# EAGLE design Nokia_Sensor_Board_V2_DIEC (EAGLE 7.7.0)
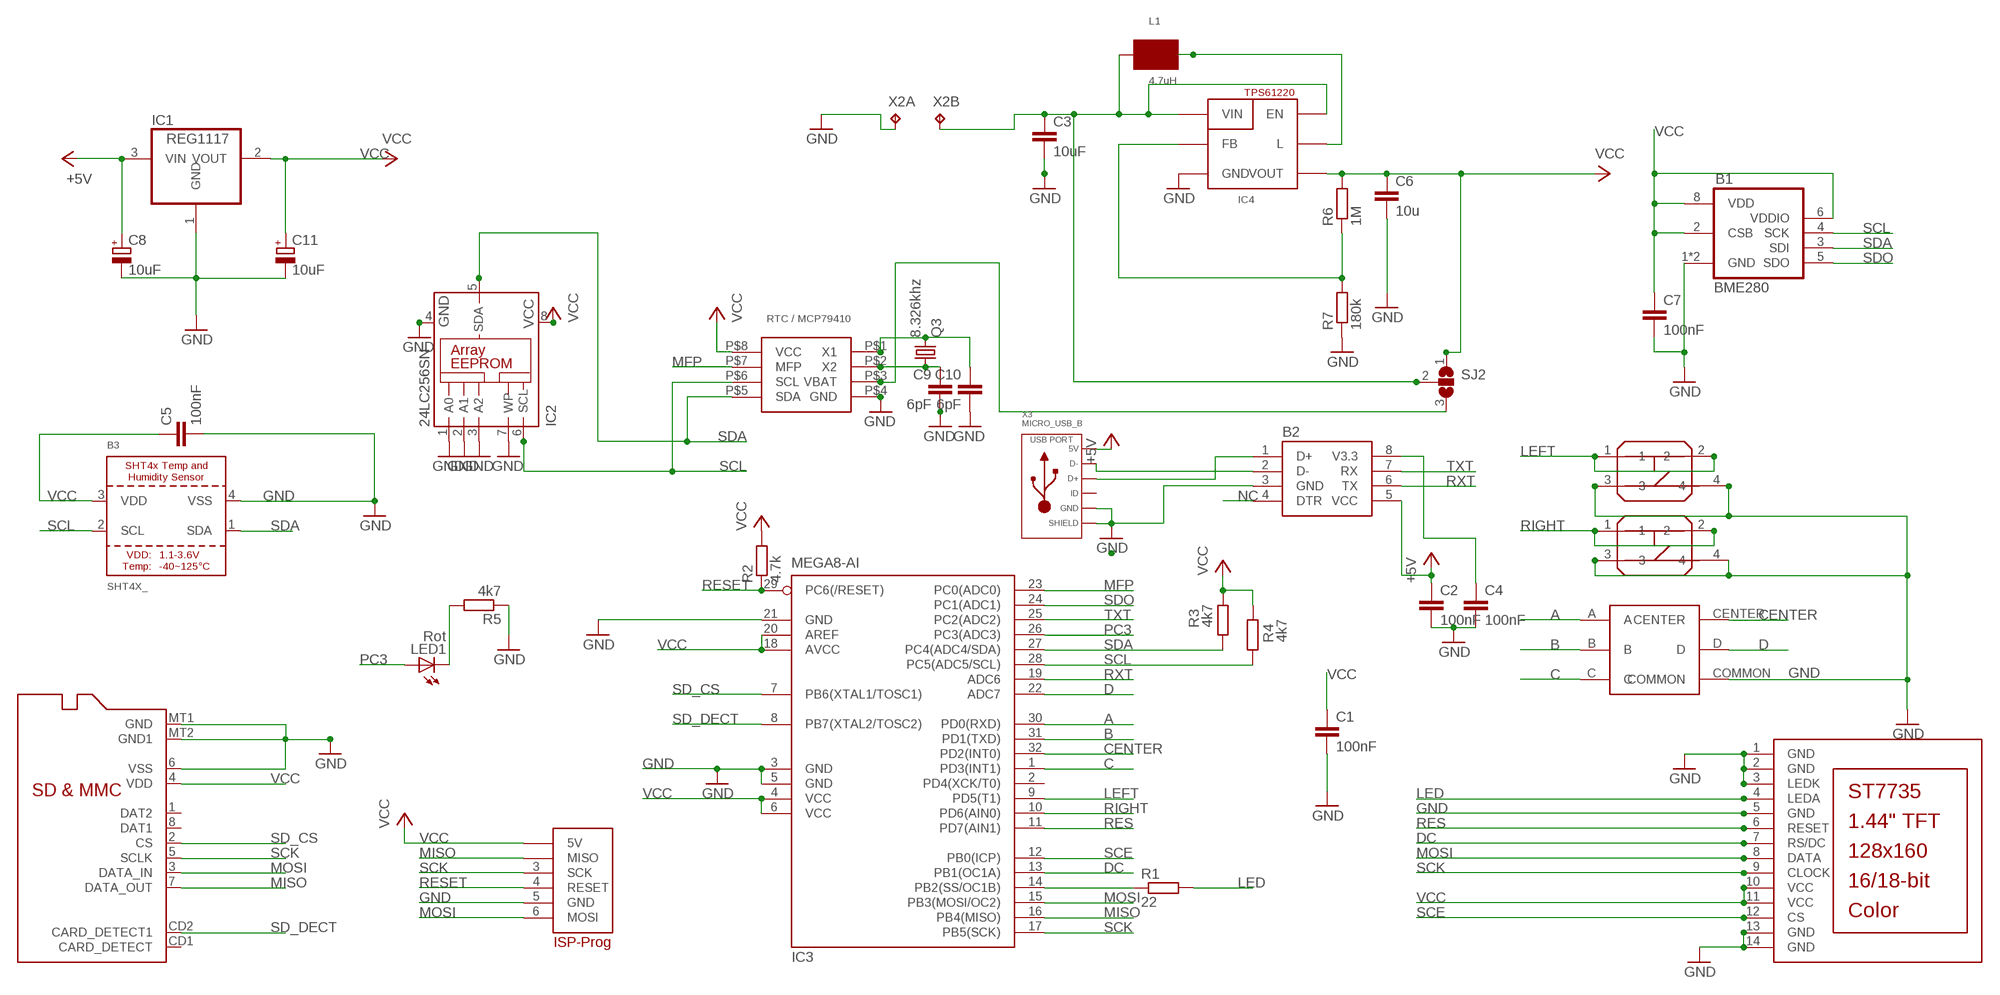
[diagram p0: schematic, sheet 1]

## Parts
B1  BME280  [BME280]
B2  CH330N  [SOIC8]
B3  SHT4X_  [SHT4X]
C1  100nF  C-EUC0805  [C0805]
C2  100nF  C-EUC0805  [C0805]
C3  10uF  C-EUC0805  [C0805]
C4  100nF  C-EUC0805  [C0805]
C5  100nF  C-EUC0805  [C0805]
C6  10u  C-EUC0805  [C0805]
C7  100nF  C-EUC0805  [C0805]
C8  10uF  CPOL-EUSMCA  [SMC_A]
C9  6pF  C-EUC0805  [C0805]
C10  6pF  C-EUC0805  [C0805]
C11  10uF  CPOL-EUSMCA  [SMC_A]
C12  MICROSD  [MICROSD]
IC1  REG1117  [SOT223]
IC2  24LC256SN  [SO-08]
IC3  MEGA8-AI  [TQFP32-08]
IC4  TPS6122X  [TPS6122X]
L1  4.7uH  SPULE_SMD  [SPULE_SMD]
LED1  Rot  LEDSML0805  [SML0805]
P1  DISP_LCD_ST7735_1.44IN  [TFT_1.44IN_128_128]
P2  MCP79410  [MCP79410]
Q3  8.326khz  CRYSTALTC38H  [TC38H]
R1  22  R-EU_M0805  [M0805]
R2  4.7k  R-EU_M0805  [M0805]
R3  4k7  R-EU_M0805  [M0805]
R4  4k7  R-EU_M0805  [M0805]
R5  4k7  R-EU_M0805  [M0805]
R6  1M  R-EU_R0805  [R0805]
R7  180k  R-EU_R0805  [R0805]
S1  TASTER_GROSS  [TASTER_GROSS]
S2  SKQUCAA010  [SKQUCAA010]
S3  TASTER_GROSS  [TASTER_GROSS]
SJ2  SJ2W  [SJ_2]
X1  ISP_PROG_STECKERJST-PH6  [ISP_PROG_JST_PH6]
X2  TP2P2-38-17  [P2-38-17]
X3  MICRO_USB_B  [MICRO_USB_B]

## Nets
+5V: B2.5(VCC) C2.1 C8.+ IC1.3(VIN) X3.1(5V)
A: IC3.30(PD0(RXD)) S2.A
B: IC3.31(PD1(TXD)) S2.B
C: IC3.1(PD3(INT1)) S2.C
CENTER: IC3.32(PD2(INT0)) S2.CENTER
D: IC3.22(ADC7) S2.D
D+: B2.1(D+) X3.3(D+)
D-: B2.2(D-) X3.2(D-)
DC: IC3.13(PB1(OC1A)) P1.7(RS/DC)
GND: B1.1(GND) B1.7(GND) B2.3(GND) B3.4(VSS) C1.2 C2.2 C3.2 C4.2 C5.2 C6.2 C7.2 C8.- C9.2 C10.2 C11.- C12.6(VSS) C12.MT1(GND) C12.MT2(GND1) IC1.1(GND) IC2.1(A0) IC2.2(A1) IC2.3(A2) IC2.4(GND) IC2.7(WP) IC3.3(GND) IC3.5(GND) IC3.21(GND) IC4.P$3(GND) P1.1(GND) P1.2(GND) P1.3(LEDK) P1.5(GND) P1.13(GND) P1.14(GND) P2.P$4(GND) R5.1 R7.1 S1.3 S1.4 S2.COMMON S3.3 S3.4 X1.5(GND) X2.TP-1 X3.5(GND) X3.S1(SLD) X3.S2(SLD) X3.S5(SLD) X3.S6(SLD) X3.S7(SLD) X3.S8(SLD)
LED: P1.4(LEDA) R1.2
LEFT: IC3.9(PD5(T1)) S1.1 S1.2
MFP: IC3.23(PC0(ADC0)) P2.P$7(MFP)
MISO: C12.7(DATA_OUT) IC3.16(PB4(MISO)) X1.2(MISO)
MOSI: C12.3(DATA_IN) IC3.15(PB3(MOSI/OC2)) P1.8(DATA) X1.6(MOSI)
N$2: P2.P$3(VBAT) SJ2.3
N$3: LED1.C R5.2
N$10: B2.8(V3.3) C4.1
N$11: IC3.14(PB2(SS/OC1B)) R1.1
N$22: IC4.P$2(FB) R6.1 R7.2
N$23: C3.1 IC4.P$1(VIN) IC4.P$6(EN) L1.P$2(.) SJ2.2 X2.TP-2
N$26: IC4.P$5(L) L1.P$1(-)
N$37: C9.1 P2.P$2(X2) Q3.1
N$38: C10.1 P2.P$1(X1) Q3.2
NC: B2.4(DTR)
PC3: IC3.26(PC3(ADC3)) LED1.A
RES: IC3.11(PD7(AIN1)) P1.6(RESET)
RESET: IC3.29(PC6(/RESET)) R2.1 X1.4(RESET)
RIGHT: IC3.10(PD6(AIN0)) S3.1 S3.2
RXT: B2.6(TX) IC3.19(ADC6)
SCE: IC3.12(PB0(ICP)) P1.12(CS)
SCK: C12.5(SCLK) IC3.17(PB5(SCK)) P1.9(CLOCK) X1.3(SCK)
SCL: B1.4(SCK) B3.2(SCL) IC2.6(SCL) IC3.28(PC5(ADC5/SCL)) P2.P$6(SCL) R4.1
SD_CS: C12.2(CS) IC3.7(PB6(XTAL1/TOSC1))
SD_DECT: C12.CD2(CARD_DETECT1) IC3.8(PB7(XTAL2/TOSC2))
SDA: B1.3(SDI) B3.1(SDA) IC2.5(SDA) IC3.27(PC4(ADC4/SDA)) P2.P$5(SDA) R3.1
SDO: B1.5(SDO) IC3.24(PC1(ADC1))
TXT: B2.7(RX) IC3.25(PC2(ADC2))
VCC: B1.2(CSB) B1.6(VDDIO) B1.8(VDD) B3.3(VDD) C1.1 C5.1 C6.1 C7.1 C11.+ C12.4(VDD) IC1.2(VOUT) IC2.8(VCC) IC3.4(VCC) IC3.6(VCC) IC3.18(AVCC) IC3.20(AREF) IC4.P$4(VOUT) P1.10(VCC) P1.11(VCC) P2.P$8(VCC) R2.2 R3.2 R4.2 R6.2 SJ2.1 X1.1(5V)
Unconnected: C12.1(DAT2) C12.8(DAT1) C12.CD1(CARD_DETECT) IC3.2(PD4(XCK/T0)) X3.4(ID)

## Library data of the parts
B1 = bosch-bme280:BME280: DIGITAL HUMIDITY, PRESSURE AND TEMPERATURE SENSOR * Digital interface I²C (up to 3.4 MHz) and SPI (3 and 4 wire, up to 10 MHz)* Supply voltage VDD main supply voltage range: 1.71 V to 3.6 V*VDDIO interface voltage range: 1.2 V to 3.6 V Operating range -40…+85 °C, 0…100 % rel. humidity, 300…1100 hPa The library has been designed by Richard Magdycz <https://www.facebook.com/groups/eaglecadsoftUK>
B2 = ch330n:CH330N
B3 = adafruit_sensor:SHT4X
C1-C7 C9 C10 = rcl:C-EU: CAPACITOR, European symbol
C8 C11 = rcl:CPOL-EU: POLARIZED CAPACITOR, European symbol
C12 = adafruit:MICROSD: Micro-SD / Transflash card holder with SPI pinout For the 3M # 2908-05WB-MG and/or 4UCON #19656 push-push type
IC1 = burr-brown:REG1117: 800mA and 1A Low Dropout (LDO) Positive Regulator 1.8V, 2.5V, 2.85V, 3.3V, 5V, and Adj; MPN: REG1117; OC_FARNELL: 1097566; OC_NEWARK: 14P6981
IC2 = microchip:24*: Serial EEPROM I2C; MF: MICROCHIP; MPN: 24LC256-I/SN; OC_FARNELL: 9757996; OC_NEWARK: 27C9144
IC3 = atmel:MEGA8: MICROCONTROLLER 8 Kbytes FLASH, 1 kbytes SRAM, 512 bytes EEPROM, USART, 6-channel 10 bit ADC, 2-channel 8 bit ADC Pin compatible with Atmega48, ATMega88, ATMega168 Source: avr.lbr; MPN: ATMEGA8-16AU; OC_FARNELL: 9171371; OC_NEWARK: 73M8863
IC4 = taster_smd_omron:TPS6122X
L1 = taster_smd_omron:SPULE_SMD
LED1 = led:LED: LED OSRAM: - CHIPLED LG R971, LG N971, LY N971, LG Q971, LY Q971, LO R971, LY R971 LH N974, LH R974 LS Q976, LO Q976, LY Q976 LO Q996 - Hyper CHIPLED LW Q18S LB Q993, LB Q99A, LB R99A - SideLED LS A670, LO A670, LY A670, LG A670, LP A670 LB A673, LV A673, LT A673, LW A673 LH A674 LY A675 LS A676, LA A676, LO A676, LY A676, LW A676 LS A679, LY A679, LG A679 - Hyper Micro SIDELED® LS Y876, LA Y876, LO Y876, LY Y876 LT Y87S - SmartLED LW L88C, LW L88S LB L89C, LB L89S, LG L890 LS L89K, LO L89K, LY L89K LS L896, LA L896, LO L896, LY L896 - TOPLED LS T670, LO T670, LY T670, LG T670, LP T670 LSG T670, LSP T670, LSY T670, LOP T670, LYG T670 LG T671, LOG T671, LSG T671 LB T673, LV T673, LT T673, LW T673 LH T674 LS T676, LA T676, LO T676, LY T676, LB T676, LH T676, LSB T676, LW T676 LB T67C, LV T67C, LT T67C, LS T67K, LO T67K, LY T67K, LW E67C LS E67B, LA E67B, LO E67B, LY E67B, LB E67C, LV E67C, LT E67C LW T67C LS T679, LY T679, LG T679 LS T770, LO T770, LY T770, LG T770, LP T770 LB T773, LV T773, LT T773, LW T773 LH T774 LS E675, LA E675, LY E675, LS T675 LS T776, LA T776, LO T776, LY T776, LB T776 LHGB T686 LT T68C, LB T68C - Hyper Mini TOPLED® LB M676 - Mini TOPLED Santana® LG M470 LS M47K, LO M47K, LY M47K Source: http://www.osram.convergy.de LUXEON: - LUMILED® LXK2-PW12-R00, LXK2-PW12-S00, LXK2-PW14-U00, LXK2-PW14-V00 LXK2-PM12-R00, LXK2-PM12-S00, LXK2-PM14-U00 LXK2-PE12-Q00, LXK2-PE12-R00, LXK2-PE12-S00, LXK2-PE14-T00, LXK2-PE14-U00 LXK2-PB12-K00, LXK2-PB12-L00, LXK2-PB12-M00, LXK2-PB14-N00, LXK2-PB14-P00, LXK2-PB14-Q00 LXK2-PR12-L00, LXK2-PR12-M00, LXK2-PR14-Q00, LXK2-PR14-R00 LXK2-PD12-Q00, LXK2-PD12-R00, LXK2-PD12-S00 LXK2-PH12-R00, LXK2-PH12-S00 LXK2-PL12-P00, LXK2-PL12-Q00, LXK2-PL12-R00 Source: www.luxeon.com KINGBRIGHT: KA-3528ASYC Source: www.kingbright.com
P1 = microbuilder:DISP_LCD_ST7735_1.44IN
P2 = taster_smd_omron:MCP79410
Q3 = crystal:CRYSTAL: CRYSTAL; OC_FARNELL: unknown; OC_NEWARK: unknown
R1-R7 = rcl:R-EU_: RESISTOR, European symbol
S1 S3 = RUAG_EL_LW:TASTER_GROSS
S2 = Joystick:SKQUCAA010
SJ2 = jumper:SJ2W: SMD solder JUMPER
X1 = LW_DUB:ISP_PROG_STECKER
X2 = testpad:TP2: Test pad
X3 = LW_DUB:MICRO_USB_B

## Board
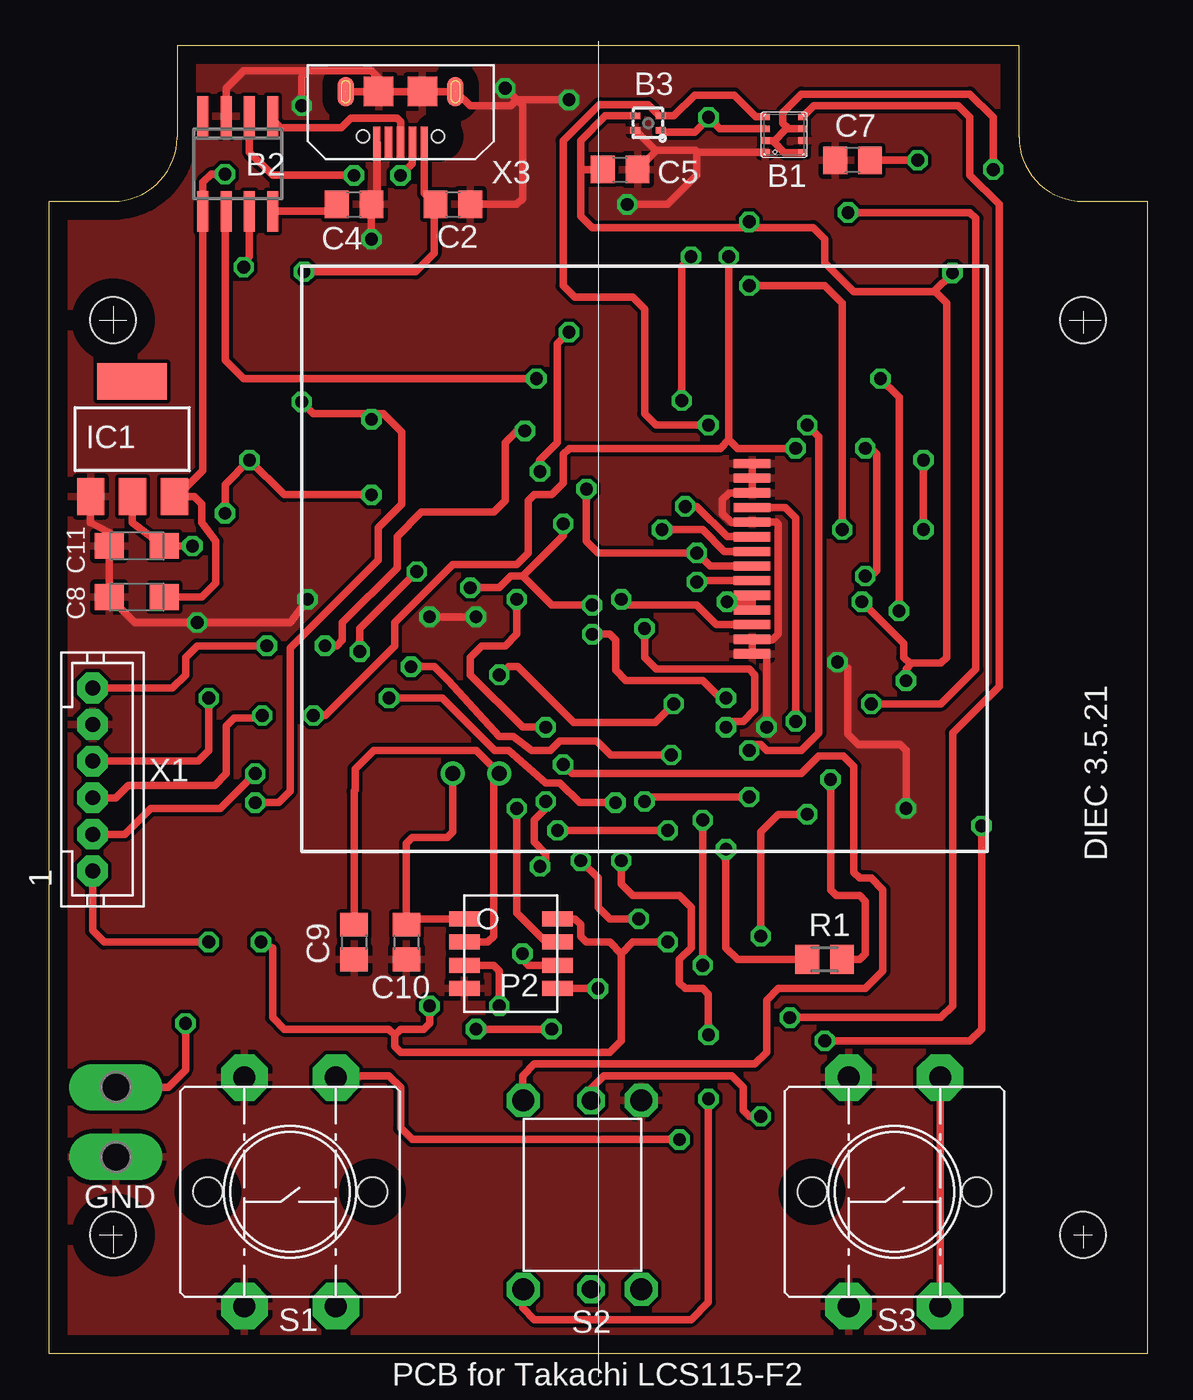
[diagram p1: board, top side]
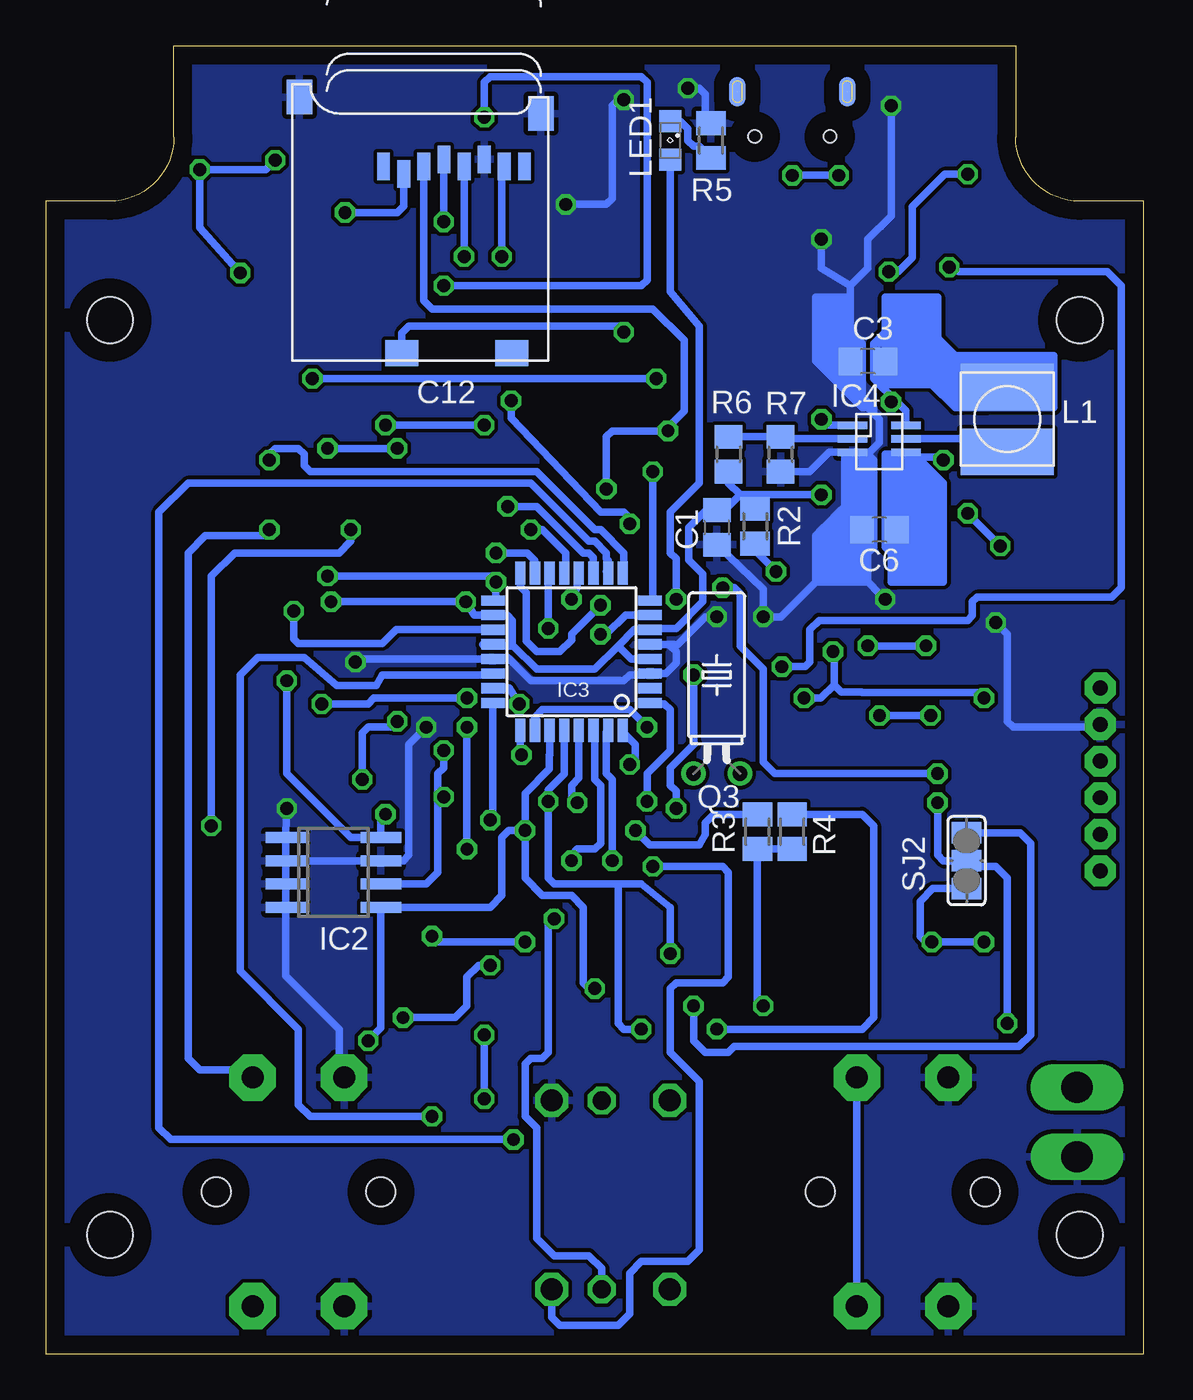
[diagram p2: board, bottom side, seen from below]

Size 60 x 71.5 mm. Coordinates in mm from the lower left corner, seen from the top.
Copper layers (1*16): Top 0.035mm / dielectric 1.5mm / Bottom 0.035mm
Design rules "default": minimum track width 10mil, minimum drill 24mil, track to track 8mil, track to pad 8mil, pad to pad 8mil, via to via 8mil, smd to smd 8mil, copper to edge 40mil, drill to drill 8mil, minimum pad ring 10mil, minimum via ring 8mil, stop-mask expansion 4mil, vias tented up to drill 0mil, thermal gap 10mil

### Footprints (pad centres in the part's own frame; a part is rotated, then mirrored left to right if it is on the bottom)
BME280 = smd 0.35 x 0.5: 1 0.975,-1.025; 2 0.325,-1.025; 3 -0.325,-1.025; 4 -0.975,-1.025; 5 -0.975,1.025; 6 -0.325,1.025; 7 0.325,1.025; 8 0.975,1.025
SOIC8 = smd 0.6 x 2.2: 1 -1.905,-2.6; 2 -0.635,-2.6; 3 0.635,-2.6; 4 1.905,-2.6; 5 1.905,2.6; 6 0.635,2.6; 7 -0.635,2.6; 8 -1.905,2.6
SHT4X = smd 0.55 x 0.35: 1 -0.7,0.4; 2 -0.7,-0.4; 3 0.7,-0.4; 4 0.7,0.4
C0805 = smd 1.3 x 1.5: 1 -0.95,0; 2 0.95,0
SMC_A = smd 1.6 x 1.4: + -1.5,0; - 1.5,0
MICROSD = smd 0.7 x 1.5: 1 9,-10.64; 2 7.9,-10.24; 3 6.8,-10.64; 4 5.7,-11.04; 5 4.6,-10.64; 6 3.5,-11.04; 7 2.4,-10.64; 8 1.3,-10.64 | smd 1.8 x 1.4: CD1 2,-0.44; CD2 8,-0.44 | smd 1.4 x 1.9: MT1 0.4,-13.54; MT2 13.6,-14.44
SOT223 = smd 1.499 x 2.007: 1 -2.261,-3.15; 2 0.025,-3.15; 3 2.311,-3.15 | smd 3.81 x 2.007: 4 0,3.15
SO-08 = smd 0.6 x 2.2: 1 -1.905,-2.6; 2 -0.635,-2.6; 3 0.635,-2.6; 4 1.905,-2.6; 5 1.905,2.6; 6 0.635,2.6; 7 -0.635,2.6; 8 -1.905,2.6
TQFP32-08 = smd 1.27 x 0.559: 1 -4.293,2.8; 2 -4.293,2; 3 -4.293,1.2; 4 -4.293,0.4; 5 -4.293,-0.4; 6 -4.293,-1.2; 7 -4.293,-2; 8 -4.293,-2.8; 17 4.293,-2.8; 18 4.293,-2; 19 4.293,-1.2; 20 4.293,-0.4; 21 4.293,0.4; 22 4.293,1.2; 23 4.293,2; 24 4.293,2.8 | smd 0.559 x 1.27: 9 -2.8,-4.293; 10 -2,-4.293; 11 -1.2,-4.293; 12 -0.4,-4.293; 13 0.4,-4.293; 14 1.2,-4.293; 15 2,-4.293; 16 2.8,-4.293; 25 2.8,4.293; 26 2,4.293; 27 1.2,4.293; 28 0.4,4.293; 29 -0.4,4.293; 30 -1.2,4.293; 31 -2,4.293; 32 -2.8,4.293
TPS6122X = smd 0.406 x 1.613: P$1 -0.31,-1.47; P$2 0.426,-1.47; P$3 1.163,-1.47; P$4 1.163,1.438; P$5 0.426,1.438; P$6 -0.31,1.438
SPULE_SMD = smd 2.54 x 5.08: P$1 -1.778,0; P$2 1.778,0
SML0805 = smd 1.2 x 1.2: A 1.05,0; C -1.05,0
TFT_1.44IN_128_128 = smd 0.5 x 2: 1 5.2,12.855; 2 4.4,12.855; 3 3.6,12.855; 4 2.8,12.855; 5 2,12.855; 6 1.2,12.855; 7 0.4,12.855; 8 -0.4,12.855; 9 -1.2,12.855; 10 -2,12.855; 11 -2.8,12.855; 12 -3.6,12.855; 13 -4.4,12.855; 14 -5.2,12.855
MCP79410 = smd 0.813 x 1.676: P$1 -2.54,-2.54; P$2 -1.27,-2.54; P$3 0,-2.54; P$4 1.27,-2.54; P$5 1.27,2.54; P$6 0,2.54; P$7 -1.27,2.54; P$8 -2.54,2.54
TC38H = drill 0.813: 1 -1.27,0; 2 1.27,0
M0805 = smd 1.3 x 1.6: 1 -0.95,0; 2 0.95,0
R0805 = smd 1.3 x 1.5: 1 -0.95,0; 2 0.95,0
TASTER_GROSS = drill 1.2 pad 2.54 octagon: 1 6.25,-2.5; 2 -6.25,-2.5; 3 6.25,2.5; 4 -6.25,2.5 | hole 1.6: 0,4.5; 0,-4.5
SKQUCAA010 = drill 1.2 octagon: A -5.01,3.14; C -5.01,-3.31; CENTER 5.31,3.14; COMMON 5.31,-3.31 | drill 1 octagon: B -5.01,-0.57; D 5.31,-0.57
SJ_2 = smd 1.168 x 1.6: 1 -1.524,0; 2 0,0; 3 1.524,0
PCB_LSC115_F2 = hole 2.5: -26.5,22.25; 26.5,22.25; 26.5,-27.75; -26.5,-27.75
ISP_PROG_JST_PH6 = drill 0.813 pad 1.676 octagon: 1 5,0; 2 3,0; 3 1,0; 4 -1,0; 5 -3,0; 6 -5,0
P2-38-17 = drill 1.702 pad 2.121 long: TP-1 -1.905,0; TP-2 1.905,0
MICRO_USB_B = smd 0.4 x 1.7: 1 -1.3,1.37; 2 -0.65,1.37; 3 0,1.37; 4 0.65,1.37; 5 1.3,1.37 | smd 0.9 x 1.6: S1 -3,-1.4; S2 3,-1.4 | smd 1.6 x 1.6: S5 -1.2,-1.405; S6 1.2,-1.405 | smd 0.9 x 1.6 bottom: S7 -3,-1.4; S8 3,-1.4 | hole 0.7: -2.05,1.05; 2.05,1.05

### Placement (x,y rotation side)
B1  40.16,66.64 270 top
B2  10.32,65.05 180 top
B3  32.73,67.27 180 top
C1  23.33,45.17 270 bottom
C2  22.06,62.83 0 top
C3  15.08,54.25 180 bottom
C4  16.66,62.83 0 top
C5  31.21,64.73 0 top
C6  14.44,45.05 180 bottom
C7  43.91,65.24 180 top
C8  4.79,41.36 180 top
C9  16.66,22.5 270 top
C10  19.52,22.5 270 top
C11  4.79,44.16 180 top
C12  32.54,54.25 180 bottom
IC1  4.54,50 0 top
IC2  44.29,26.31 270 bottom
IC3  31.27,38.38 180 bottom
IC4  14.44,50.44 270 bottom
L1  7.46,51.08 90 bottom
LED1  25.87,66.32 270 bottom
P1  51.27,43.46 90 top
P2  25.24,21.23 270 top
Q3  23.33,31.71 0 bottom
R1  42.38,21.55 0 top
R2  21.24,45.24 90 bottom
R3  21.11,28.54 270 bottom
R4  19.21,28.54 270 bottom
R5  23.65,66.32 270 bottom
R6  22.7,49.17 270 bottom
R7  19.84,49.17 90 bottom
S1  46.19,8.85 90 top
S2  29.05,8.53 90 top
S3  13.17,8.85 90 top
SJ2  9.68,26.95 90 bottom
U$1  [PCB_LSC115_F2]  30,34.25 0 top
X1  2.38,31.39 270 top
X2  3.65,12.66 90 top
X3  19.21,67.59 180 top

### Tracks (layer width: path | path; a pad name or v marks a point on that pad's centre or on a via)
+5V  (via drill 0.7)
  Top 0.406: C2.1 21.05,62.89 | X3.1 20.5,63.43 21.05,62.89 | C8.+ 8.35,41.36 9.11,42.13 9.11,44.41 8.35,45.43 8.35,46.44 7.94,46.85 IC1.3 6.97,46.85 8.41,48.29 B2.5 8.41,64.03 8.85,64.48 v9.62,64.48 | 21.05,62.89 21.05,60.16 20.03,59.14 v13.93,59.14
  Bottom 0.406: v9.62,64.48 10.89,64.48 12.66,62.7 12.66,59.91 13.43,59.14 v13.93,59.14
A  (via drill 0.7)
  Top 0.406: S2.A 25.87,3.49 25.87,2.5 26.51,1.87 35.08,1.87 36.03,2.82 v36.03,13.93 | v31.27,26.95 31.27,25.68 31.9,25.04 34.44,25.04 35.08,24.41 35.08,22.19 34.44,21.55 34.44,20.28 34.76,19.97 35.71,19.97 36.03,19.65 v36.03,17.42
  Bottom 0.406: IC3.30 30,34.02 30,31.4 29.68,31.08 29.68,27.9 30,27.58 30.95,27.58 31.27,27.27 v31.27,26.95 | v36.03,13.93 v36.03,17.42
B  (via drill 0.7)
  Top 0.406: v29.05,26.95 30,26 30,24.41 30.63,23.77 v32.22,23.77
  Bottom 0.406: v29.05,26.95 29.05,31.4 29.37,31.71 29.37,33.99 29.27,33.99 IC3.31 | S2.B 29.62,4.66 30.32,5.36 32.22,5.36 33.17,6.31 33.17,12.35 33.81,12.98 33.81,15.84 33.49,16.15 32.86,16.15 32.54,16.47 32.54,23.46 v32.22,23.77
C  (via drill 0.7)
  Top 0.406: v26.83,26.63 27.14,26.95 27.14,27.33 26.51,27.97 26.51,29.17 27.14,29.81 v27.14,30.19
  Bottom 0.406: IC3.1 26.92,35.52 26.19,35.52 25.87,35.2 25.87,32.98 27.14,31.71 v27.14,30.19 | S2.C 32.36,2 31.9,1.55 28.73,1.55 28.1,2.19 28.1,4.41 27.46,5.04 24.92,5.04 24.28,5.68 24.28,14.88 25.87,16.47 25.87,19.97 25.56,20.28 23.01,20.28 22.7,20.6 22.7,26.31 23.01,26.63 v26.83,26.63
CENTER  (via drill 0.7 pad 0.3)
  Top 0.406: S2.CENTER 25.87,13.88 25.87,15.2 26.51,15.84 38.57,15.84 39.21,16.47 39.21,19.33 39.84,19.97 44.6,19.97 45.56,20.92 45.56,25.36 44.92,26 44.29,26 43.97,26.31 43.97,32.09 43.4,32.67 42.06,32.67 41.11,31.71 28.59,31.71 v28.09,32.21
  Bottom 0.406: 28.41,34.03 IC3.32 28.47,33.99 27.78,33.3 27.78,32.53 v28.09,32.21
D  (via drill 0.7)
  Top 0.406: S2.D 29.62,14.5 30.32,15.2 37.3,15.2 37.94,14.57 37.94,13.3 38.26,12.98 v38.89,12.98
  Bottom 0.406: IC3.22 35.63,37.11 41.62,37.11 41.94,36.54 44.1,36.54 45.88,38.06 48.42,38.06 49.37,37.11 49.37,20.92 46.19,17.74 46.19,13.61 45.56,12.98 v38.89,12.98
D+
  Top 0.406: B2.1 12.22,67.46 12.66,67.02 15.97,67.02 16.47,67.53 19.01,67.53 19.21,67.34 X3.3
D-  (via drill 0.7)
  Top 0.406: B2.2 10.95,65.68 12.22,64.42 v16.66,64.42 | v19.21,64.42 19.86,65.06 X3.2
  Bottom 0.406: v16.66,64.42 v19.21,64.42
DC  (via drill 0.7)
  Top 0.406: v33.49,45.05 35.71,45.05 36.9,43.86 P1.7
  Bottom 0.406: IC3.13 31.59,42.76 31.59,43.78 32.86,45.05 v33.49,45.05
GND  (via drill 0.7, 0.7 pad 0.3)  (2 unrouted)
  Top 0.406: 37.78,38.23 P1.14 | P1.1 P1.2 P1.3 37.16,47.06 36.79,46.7 36.79,45.94 37.3,45.43 38.39,45.43 P1.5 39.75,45.46 39.84,45.37 39.84,39.33 39.53,39.02 38.37,39.02 P1.13 P1.14 | v14.13,41.24 13.17,39.97 v8.09,39.97 4.69,39.97 C8.- C11.- 3.29,44.9 2.25,45.43 2.25,46.83 IC1.1 | v20.79,40.28 v23.33,40.28 | v39.21,34.25 39.21,38.06 39.01,38.26 P1.14 | X3.S6 17.94,69.06 17.94,69.81 17.62,70.13 14.13,70.13 | 14.13,70.13 13.81,69.81 v13.81,68.23 | X3.S8 X3.S6 | C4.2 17.9,63.12 X3.5 17.94,66.19 17.94,62.51 17.62,62.19 v17.62,60.92 | v43.08,37.81 43.65,37.49 43.65,33.87 44.22,33.3 46.51,33.3 46.83,32.98 v46.83,29.81 | 39.11,65.68 35.4,65.68 | 35.4,65.68 35.3,65.78 33.12,65.78 | C2.2 25.56,62.83 25.87,63.14 25.87,68.23 25.56,68.54 | 25.56,68.54 v28.41,68.54 | v31.59,62.83 33.81,62.83 35.4,64.42 35.4,65.68 | X3.S6 X3.S5 X3.S7 22.65,68.54 22.7,68.54 23.01,68.23 25.24,68.23 25.56,68.54 | B2.3 9.68,69.18 10.63,70.13 14.13,70.13 | v24.92,69.18 25.56,68.54 | B3.4 33.12,65.78 | C5.2 33.12,65.7 33.12,65.78
  Bottom 0.406: v8.09,39.97 7.46,39.33 7.46,34.57 7.14,34.25 2.52,34.25 X1.5 | IC2.2 IC2.1 46.89,28.48 v46.83,29.81 | IC2.2 IC2.3 IC2.4 46.89,20.66 43.97,17.74 43.97,15.38 | IC2.2 IC2.7 40.48,26.95 40.16,27.27 40.16,33.3 v39.21,34.25 | 26.91,37.11 IC3.3 | C6.2 14.76,45.68 | 14.76,45.68 14.76,44.1 15.08,43.78 15.08,43.14 | 15.08,43.14 15.08,42.19 17.94,42.19 | 17.94,42.19 17.94,44.73 17.62,45.05 | 17.3,45.37 16.66,46 | 15.71,48.54 15.71,49.08 IC4.P$3 | 15.71,45.68 15.71,43.78 | 15.39,43.46 15.08,43.14 | IC4.P$3 16.03,49.16 16.03,44.1 15.71,44.41 15.08,44.41 15.08,44.1 15.39,44.1 15.39,43.46 | 15.39,43.46 15.39,43.14 | 15.39,43.14 15.39,42.51 | 15.39,42.51 17.62,42.51 17.62,42.82 15.71,42.82 15.39,43.14 | 15.39,43.14 17.62,43.14 17.62,43.46 15.39,43.46 | 15.39,43.46 15.71,43.78 | 15.71,43.78 17.62,43.78 17.62,44.1 16.35,44.1 16.35,44.41 17.62,44.41 17.62,44.73 16.35,44.73 16.35,45.05 17.62,45.05 | 17.62,45.05 17.3,45.37 | 17.3,45.37 16.66,45.37 16.35,45.68 16.66,45.68 16.35,45.37 16.35,46 16.66,46 | 16.66,46 16.35,46.32 | 16.35,46.32 16.35,49.17 15.71,48.54 | 15.71,48.54 15.71,45.68 | 15.71,45.68 15.39,45.68 15.39,49.17 14.76,48.54 | 14.76,47.91 14.76,45.68 | 14.76,45.68 | 14.76,45.68 15.08,45.68 15.08,48.54 14.76,48.86 | 14.76,48.86 14.76,48.54 | 16.35,46.32 14.76,47.91 | 14.76,47.91 14.76,48.54 | 14.76,48.86 15.08,49.17 | 16.03,49.17 15.08,49.17 | 15.08,52.03 15.39,52.35 15.39,55.21 16.03,55.84 16.03,57.11 | 16.03,57.11 16.03,57.75 | 16.03,57.75 16.35,57.75 | 16.35,57.75 17.94,57.75 17.94,57.11 | 17.94,57.11 17.94,56.48 | 17.94,56.48 17.94,54.25 15.39,51.71 15.08,51.71 | 14.76,51.4 14.76,51.71 15.08,52.03 | 15.08,52.03 15.39,52.03
  Bottom 0.406: 15.39,52.03 15.08,51.71 | 15.39,52.03 16.03,52.67 16.03,52.99 15.71,52.67 15.71,55.21 16.66,55.21 | 16.66,55.21 16.98,55.21 17.3,55.52 17.3,55.84 | 17.3,55.84 16.98,55.52 16.35,55.52 | 16.35,55.52 16.03,55.52 16.35,55.84 | 16.66,56.16 16.35,55.84 | 16.35,55.84 16.35,55.52 | 16.35,55.84 16.35,56.48 | 16.35,56.48 16.35,57.75 | 16.35,57.75 16.66,57.43 17.62,57.43 17.94,57.11 | 17.94,57.11 16.03,57.11 | 16.03,57.11 16.35,56.8 17.62,56.8 17.3,56.48 | 17.3,56.48 16.35,56.48 | 17.3,56.48 17.94,56.48 | 17.94,56.48 17.62,56.16 | 17.62,56.16 17.3,55.84 | 17.3,55.84 16.66,55.84 16.98,56.16 17.62,56.16 | 17.62,56.16 17.62,54.57 17.3,54.25 | 16.98,53.94 16.35,53.3 16.35,52.99 17.62,54.25 17.3,54.57 | 17.3,54.57 17.3,55.21 16.66,54.57 16.66,55.21 | 16.66,55.21 17.3,54.57 | 17.3,54.57 17.3,54.25 | 17.3,54.25 16.98,53.94 | 16.98,53.94 16.66,53.94 | 16.66,53.94 16.03,53.3 | 16.66,53.94 17.3,54.57 | 17.3,54.57 16.98,54.57 16.66,54.25 C3.2 | R7.1 18.25,48.22 17.19,49.28 IC4.P$3 | v14.13,41.24 15.39,42.51 | 17.94,42.19 19.84,40.28 v20.79,40.28 20.79,41.81 C1.2 | IC3.3 26.12,37.18 25.56,37.74 25.56,38.38 25.96,38.78 IC3.5 25.47,38.78 23.97,40.28 v23.33,40.28 23.65,40.28 | 15.08,51.71 14.76,51.4 | 14.76,51.4 14.44,51.08 14.44,49.81 15.08,49.17 | 16.03,58.38 16.03,57.75 | v28.41,68.54 28.73,68.54 29.05,68.23 29.05,63.14 29.37,62.83 v31.59,62.83 | v17.62,60.92 17.62,59.34 16.03,58.38 | 23.33,66.95 R5.1 23.97,67.59 23.97,68.86 24.28,69.18 v24.92,69.18 | C12.6 | IC3.3 27.05,37.11 28.1,37.11 28.41,36.79 33.49,36.79 34.76,38.06 34.92,38.06 35,37.98 IC3.21 42.91,37.98 v43.08,37.81 | 16.03,58.38 15.08,59.34 15.08,60.92 13.81,62.19 v13.81,68.23
  pour Top: -2.38,72.67 61.11,72.99 62.03,-0.76 -2.1,-1.39
  pour Bottom: -1.43,72.67 -1.75,-0.67 63.34,-0.36 63.02,72.99
LED  (via drill 0.7)
  Top 0.406: v42.7,31.4 42.7,25.36 43.02,25.04 44.29,25.04 44.6,24.73 44.6,21.87 44.29,21.55 R1.2 | v40.79,34.57 40.79,45.68 40.22,46.26 P1.4
  Bottom 0.406: v40.79,34.57 41.11,34.25 42.38,34.25 42.7,33.93 v42.7,31.4
LEFT  (via drill 0.7, 0.7 pad 0.3)
  Top 0.406: 48.63,2.6 S1.2 S1.1 | v47.78,48.86 v47.78,45.05
  Bottom 0.406: v47.78,45.05 48.1,44.73 51.27,44.73 52.23,43.78 52.23,16.15 51.59,15.52 49.11,15.52 S1.1 | v47.78,48.86 47.78,49.17 47.46,49.49 46.19,49.49 45.88,49.17 45.88,48.54 45.56,48.22 33.17,48.22 30,45.05 29.68,45.05 28.41,43.78 28.41,42.73 IC3.9
MFP  (via drill 0.7, 0.7 pad 0.3)
  Top 0.406: v25.56,29.81 25.56,24.09 27.14,22.51 P2.P$7 | v34.13,35.52 33.11,34.51 28.67,34.51 25.62,37.55 25.11,37.55 24.67,37.11 v24.6,37.11
  Bottom 0.406: v34.13,35.52 34.67,36.38 IC3.23 | v25.56,29.81 25.56,30.76 25.87,31.08 25.87,32.03 24.54,33.36 24.6,33.36 24.6,33.43 24.6,33.49 v24.6,37.11
MISO  (via drill 0.7)
  Top 0.406: v11.27,31.71 9.36,29.81 5.55,29.81 4.14,28.4 X1.2 | 28.1,40.92 v29.68,40.92 27.46,40.92 25.87,42.51 | v23.01,41.87 24.6,41.87 25.24,42.51 25.87,42.51 | 25.87,42.51 28.1,44.73 v28.1,45.37 | v35.08,59.97 34.57,59.46 v34.57,52.1
  Bottom 0.406: v11.27,31.71 20.16,31.71 20.79,32.35 20.79,37.43 22.06,38.7 22.06,41.56 22.38,41.87 v23.01,41.87 | 34.13,42.62 IC3.16 34.07,41.94 33.75,41.62 33.75,38.95 33.17,38.38 31.9,38.38 31.27,39.02 31.27,39.33 v29.68,40.92 | v35.08,59.97 35.08,64.76 C12.7 | v28.1,45.37 28.1,45.68 28.41,46 29.68,46 34.57,51.14 v34.57,52.1
MOSI  (via drill 0.7)
  Top 0.406: v26,50.45 25.56,50.45 24.92,49.81 24.92,46.63 24.28,46 20.35,46 19.01,44.67 19.01,42.95 16.03,39.97 16.03,39.02 15.71,38.7 v15.08,38.7 | v11.9,38.7 8.09,38.7 7.46,38.06 7.46,37.11 6.74,36.39 X1.6 | P1.8 36.12,43.06 v35.4,43.78 30,43.78 29.37,44.41 v29.37,47.27
  Bottom 0.406: 39.21,64.76 C12.3 39.34,57.56 38.89,57.11 26.83,57.11 25.11,55.4 25.11,51.52 26,50.64 v26,50.45 29.05,50.45 29.37,50.13 v29.37,47.27 | v11.9,38.7 v15.08,38.7 | IC3.15 33.27,43.37 33.68,43.78 v35.4,43.78
N$2  (via drill 0.7)
  Top 0.406: v24.6,19.01 24.6,20.92 24.28,21.24 P2.P$3
  Bottom 0.406: SJ2.3 6.76,28.47 6.19,27.9 6.19,17.42 6.82,16.79 22.38,16.79 22.7,16.47 23.97,16.47 24.6,17.11 v24.6,19.01
N$3
  Bottom 0.406: LED1.C 25.33,67.37 24.92,66.95 24.92,66.32 24.6,66 24.28,66 R5.2
N$10
  Top 0.406: C4.1 15.34,62.45 B2.8
N$11  (via drill 0.7)
  Top 0.406: v36.99,27.58 36.99,22.19 37.62,21.55 R1.1 | v36.99,34.25 37.3,34.57 37.94,34.57 38.57,35.2 38.57,37.11 38.26,37.43 33.17,37.43 32.54,38.06 v32.54,39.65
  Bottom 0.406: IC3.14 32.54,42.6 v32.54,39.65 | v36.99,34.25 v36.99,27.58
N$22
  Bottom 0.406: R6.1 R7.2 19.73,50.02 IC4.P$2
N$23  (via drill 0.7)
  Top 0.406: v13.81,52.03 14.44,51.4 17.94,51.4 | v17.62,51.08 17.94,51.4 | 17.94,51.4 18.25,51.4 19.27,50.38 19.27,46.44 18,45.17 18,43.4 13.17,38.57 13.17,30.76 12.54,30.13 v11.27,30.13 | v7.46,18.06 7.46,15.52 6.5,14.57 X2.TP-2
  Bottom 0.406: L1.P$2 8.6,51.71 | 8.6,51.71 9.05,51.71 | 9.05,51.71 10.32,51.71 11.59,52.99 | 11.59,52.99 14.44,52.99 | 14.44,52.99 14.76,53.3 14.76,55.21 14.44,55.52 | 14.44,55.52 14.13,55.52 | 14.44,55.21 14.13,55.52 | 14.13,55.52 14.13,55.84 | 14.44,55.52 14.13,55.84 | 14.13,55.84 14.13,57.75 11.27,57.75 11.27,55.52 | 11.27,55.52 10.95,55.21 | 10.95,55.21 10.32,54.57 | 10.32,54.57 4.92,54.57 4.92,51.71 8.6,51.71 | 9.05,51.71 6.5,54.25 | 6.5,54.25 5.24,54.25 | 6.5,54.25 9.36,54.25 | 9.36,54.25 10,54.25 | 10,54.25 10.32,54.57 | 11.9,56.16 12.22,56.48 | 12.54,56.8 13.17,57.43 | 13.17,57.43 13.81,57.43 | 13.17,57.43 11.59,57.43 11.59,55.84 | 11.9,56.16 11.9,57.11 | 11.9,57.11 12.22,56.8 12.22,56.48 | 12.22,56.48 12.54,56.8 | 12.54,56.8 12.54,57.11 | 12.54,57.11 11.9,57.11 | 12.54,57.11 13.81,57.11 13.81,56.48 | 13.81,56.48 14.13,56.16 14.13,55.21 | 14.13,55.21 13.81,54.89 11.9,54.89 | 11.9,54.89 10.95,54.89 10.32,54.25 10,54.25 | 9.36,54.25 9.68,53.94 | 9.68,53.94 10,53.62 | 10,53.62 10,52.99 | 10,52.99 10,52.03 11.9,53.94 11.9,54.57 | 11.9,54.57 11.9,54.89 | 11.9,54.89 11.59,54.57 | 10,52.99 10.95,53.94 | 10.95,53.94 11.27,54.25 | 11.27,54.25 11.59,54.25 10.63,53.3 | 10.63,53.3 10.63,52.99 10.32,52.67 10.32,52.03 11.9,53.62 12.22,53.62 | 12.22,53.62 12.54,53.3 | 12.54,53.3 14.44,53.3 | 12.54,53.3 11.9,53.3 11.59,52.99 | 11.59,52.99 10.32,52.99 10.63,53.3 | 10.63,53.3 10.95,53.3 11.27,53.62 | 11.59,53.94 11.27,53.62 | 11.27,53.62 10,53.62 | 10,53.62 10.32,53.94 | 10.32,53.94 10.95,54.57 11.59,54.57 | 11.59,54.57 11.27,54.25 | 10.95,53.94 10.63,53.94 | 10.95,54.25 10.63,53.94 | 10.63,53.94 10.32,53.94 | 10.32,53.94 9.68,53.94 | 9.68,53.94 10,54.25 | 11.59,55.84 11.9,56.16
  Bottom 0.406: 12.54,56.8 13.49,56.8 13.17,56.48 | 11.9,55.21 10.95,55.21 | 11.27,55.52 11.59,55.84 | 12.22,56.48 12.85,56.48 11.9,55.52 11.59,55.52 12.54,56.48 13.17,56.48 | 13.49,56.48 13.81,56.48 | 13.81,56.48 13.81,56.16 12.85,55.21 11.9,55.21 | 11.9,55.21 13.17,56.48 | 13.17,56.48 13.49,56.48 | 13.49,56.48 13.49,56.16 | 13.49,56.16 12.85,55.52 12.54,55.52 13.17,56.16 13.49,56.16 | 13.49,56.16 13.81,55.84 13.81,55.21 13.17,55.21 | 13.17,55.21 13.49,55.52 | 13.17,55.21 12.54,54.57 11.9,54.57 | 11.9,54.57 12.85,53.62 | 12.85,53.62 13.49,53.62 | 12.85,53.62 12.22,53.62 | 12.22,53.62 12.22,53.94 13.49,53.94 13.49,54.25 12.54,54.25 12.85,54.57 13.49,54.57 14.13,53.94 | 14.44,53.62 14.13,53.94 | 14.13,53.94 14.13,55.21 | 14.13,55.21 14.13,55.2 C3.1 | IC4.P$1 17.29,50.75 v17.62,51.08 | 13.81,52.35 13,51.55 IC4.P$6 | 14.44,52.99 13.81,52.35 | 13.81,52.35 v13.81,52.03 | v11.27,30.13 11.27,27.27 10.95,26.95 SJ2.2 9.36,26.63 8.09,26.63 7.46,26 v7.46,18.06
N$26
  Bottom 0.406: L1.P$1 8.17,50.02 IC4.P$5
N$37
  Top 0.406: P2.P$2 23.97,22.51 24.28,22.82 24.28,31.4 Q3.1 23.33,32.98 17.74,32.98 16.73,31.97 16.73,30.82 16.66,30.76 C9.1
N$38
  Top 0.406: Q3.2 22.06,31.08 22.06,30.45 22.06,28.54 21.74,28.22 19.84,28.22 19.52,27.9 C10.1 19.84,23.77 P2.P$1
PC3  (via drill 0.7)
  Top 0.406: v25.56,41.24 25.56,39.33 24.92,38.7 23.65,38.7 23.01,38.06 23.01,37.11 25.87,34.25 v27.14,34.25
  Bottom 0.406: 33.17,34.18 IC3.26 33.27,34.79 32.86,35.2 28.1,35.2 v27.14,34.25 | LED1.A 25.87,58.06 24.28,56.16 24.28,47.59 25.87,46 25.87,43.78 25.56,43.46 v25.56,41.24
RES  (via drill 0.7)
  Top 0.406: v34.76,46.32 35.4,46.32 37.06,44.66 P1.6
  Bottom 0.406: IC3.11 30.07,43.53 30.32,43.78 30.63,43.78 33.17,46.32 v34.76,46.32
RESET  (via drill 0.7)
  Top 0.406: v16.98,38.38 16.98,39.65 v20.09,42.76 | v8.73,35.84 8.73,32.98 8.14,32.39 X1.4 | v30.95,30.13 28.98,30.13 27.9,31.2 27.14,31.2 25.11,32.98 24.35,32.98 21.49,35.84 v18.57,35.84
  Bottom 0.406: 30.95,34 IC3.29 30.87,31.48 31.27,31.08 31.27,30.44 v30.95,30.13 | v8.73,35.84 9.05,36.16 15.39,36.16 15.4,36.16 16.52,36.16 16.92,36.56 | 18.55,35.86 v18.57,35.84 17.64,35.84 16.92,36.56 | v16.98,38.38 16.92,38.32 16.92,36.56 | v20.09,42.76 21.24,43.9 R2.1
RIGHT  (via drill 0.7)
  Top 0.406: v34.44,11.71 19.84,11.71 19.21,12.35 19.21,14.57 18.57,15.2 16.98,15.2 16.88,15.1 S3.1
  Bottom 0.406: v34.44,11.71 53.18,11.71 53.81,12.35 53.81,46 52.23,47.59 33.49,47.59 30.32,44.41 30,44.41 29.37,43.78 29.37,43.46 29.27,43.37 IC3.10 29.37,42.77 | S3.2 S3.1
RXT  (via drill 0.7)
  Top 0.406: B2.6 9.62,62.39 9.62,54.32 10.63,53.3 v26.63,53.3 | v45.43,53.3 46.45,52.29 v46.45,40.6
  Bottom 0.406: v26.63,53.3 v45.43,53.3 | IC3.19 40.86,39.59 41.62,38.82 46.19,38.82 46.45,39.08 v46.45,40.6
SCE  (via drill 0.7)
  Top 0.406: v31.27,41.24 31.59,40.92 35.4,40.92 36.46,39.86 P1.12
  Bottom 0.406: IC3.12 30.95,42.59 30.95,41.87 v31.27,41.24
SCK  (via drill 0.7)
  Top 0.406: v14.44,34.89 15.08,34.89 18.89,38.7 18.89,39.97 22.06,43.14 25.56,43.14 26.19,43.78 26.19,46.63 26.51,46.95 27.46,46.95 28.1,47.59 28.1,49.17 28.41,49.49 36.67,49.49 37.14,49.96 | 37.14,49.96 v37.14,59.97 | X1.3 3.65,30.4 4.33,31.08 9.05,31.08 9.68,31.71 9.68,34.32 10.12,34.76 11.52,34.76 v11.65,34.89 | v44.6,49.49 44.92,49.49 45.24,49.17 45.24,42.82 44.92,42.51 v44.6,42.51 | v40.79,49.49 37.62,49.49 37.15,49.96 37.14,49.96 | v35.4,42.19 35.47,42.26 P1.9
  Bottom 0.406: v11.65,34.89 v14.44,34.89 | v37.14,59.97 C12.5 | IC3.17 35.4,41.35 v35.4,42.19 35.71,42.51 v44.6,42.51 | v44.6,49.49 v40.79,49.49
SCL  (via drill 0.7, 0.7 pad 0.3)
  Top 0.406: v25.87,21.87 25.87,21.55 26.19,21.24 P2.P$6 | v23.33,17.74 v27.46,17.74 | v36.03,50.76 33.17,50.76 32.54,51.4 32.54,57.11 31.9,57.75 28.73,57.75 28.1,58.38 28.1,66.32 30.06,68.29 32.73,68.29 33.35,67.67 B3.2 34.15,67.67 35.27,68.8 37.44,68.8 38.63,67.61 B1.4 | v41.43,50.76 42.06,50.13 42.06,33.93 41.11,32.98 39.21,32.98 38.89,33.3 38.57,33.3 v38.26,32.98 | v32.54,30.19 32.79,30.44 v38.26,30.44
  Bottom 0.406: IC2.6 39.21,25.68 38.57,26.31 38.57,30.13 v38.26,30.44 38.57,30.76 38.57,31.71 38.26,32.03 v38.26,32.98 | IC3.28 31.67,31.69 32.54,30.82 v32.54,30.19 32.54,26 32.22,25.68 28.73,25.68 | 28.73,25.68 27.46,25.68 25.87,24.41 v25.87,21.87 | R4.1 15.39,29.49 14.76,28.85 14.76,18.38 15.39,17.74 v23.33,17.74 | v27.46,17.74 28.41,17.74 28.73,18.06 28.73,25.68 | v36.03,50.76 v41.43,50.76
SD_CS  (via drill 0.7)
  Top 0.406: v43.65,62.38 50.32,62.38 50.64,62.07 50.64,37.43 48.73,35.52 v44.92,35.52 | v29.68,39.33 30.63,39.33 30.95,39.02 30.95,37.36 31.52,36.79 35.71,36.79 36.67,35.84 v36.99,35.84
  Bottom 0.406: IC3.7 28.32,40.38 29.37,39.33 v29.68,39.33 | v43.65,62.38 40.79,62.38 40.44,62.74 C12.2 | v36.99,35.84 42.06,35.84 42.38,35.52 v44.92,35.52
SD_DECT  (via drill 0.7)
  Top 0.406: v26.83,48.22 26.83,48.86 27.78,49.81 27.78,55.21 v28.41,55.84
  Bottom 0.406: IC3.8 26.83,41.33 v26.83,48.22 | C12.CD2 40.54,55.78 40.16,56.16 28.73,56.16 v28.41,55.84
SDA  (via drill 0.7, 0.7 pad 0.3)
  Top 0.406: v33.81,28.6 v27.78,28.6 | P2.P$5 v30,19.97 | v43.34,45.05 43.34,57.43 42.38,58.38 v38.26,58.38 | v42.38,17.11 50.32,17.11 50.96,17.74 v50.96,28.85 | B1.3 36.66,66.96 v36.03,67.59 36.03,67.53 35.27,66.76 33.54,66.76 B3.1
  Bottom 0.406: R3.1 23.49,29.49 23.97,29.01 23.97,28.38 24.28,27.81 26.98,27.81 v27.78,28.6 | v33.81,28.6 33.81,30.63 32.48,31.97 32.48,32.73 32.47,32.74 IC3.27 | IC2.5 35.71,24.41 35.08,25.04 35.08,28.22 34.7,28.6 v33.81,28.6 | v30,19.97 30.32,19.97 30.63,20.28 30.63,24.41 31.27,25.04 32.86,25.04 33.81,26 v33.81,28.6 | v38.26,58.38 27.46,58.38 27.14,58.7 27.14,69.49 27.46,69.81 35.71,69.81 36.03,69.49 v36.03,67.59 | IC2.5 41.75,24.35 | v50.96,28.85 50.96,42.51 49.68,43.78 43.97,43.78 43.34,44.41 v43.34,45.05 | v42.38,17.11 41.69,17.8 IC2.5
SDO  (via drill 0.7)
  Top 0.406: B1.5 41.8,68.23 49.68,68.23 50.32,67.59 50.32,64.42 51.91,62.83 51.91,36.48 49.37,33.93 49.37,19.01 48.73,18.38 v40.48,18.38 | v35.71,21.24 v35.71,29.17
  Bottom 0.406: v35.71,29.17 35.56,29.32 IC3.24 | v40.48,18.38 37.62,18.38 36.99,19.01 36.99,20.6 36.35,21.24 v35.71,21.24
TXT  (via drill 0.7)
  Top 0.406: v34,32.73 30.7,32.73 29.94,33.49 27.9,33.49 27.4,32.98 26.38,32.98 25.36,33.74 24.6,33.74 21.81,36.79 21.05,37.55 v19.78,37.55 | v10.63,59.4 10.95,59.97 B2.7
  Bottom 0.406: IC3.25 34.07,32.8 v34,32.73 | v19.78,37.55 18.51,37.55 18.25,37.81 18.25,39.59 17.74,40.09 9.62,40.09 9.36,40.35 9.36,41.11 9.11,41.36 1.74,41.36 1.23,41.87 1.23,58.38 2,59.14 10.12,59.14 v10.63,59.4
VCC  (via drill 0.7, 0.7 pad 0.3)
  Top 0.406: v17.62,46.95 12.85,46.95 v10.95,48.86 9.62,47.52 v9.62,45.94 | v8.73,22.51 3.01,22.51 2.38,23.14 X1.1 | 31.27,21.87 31.27,17.11 30.63,16.47 21.43,16.47 21.42,16.46 20.16,16.47 19.21,16.47 18.89,16.79 18.89,17.42 | 31.27,21.87 31.9,22.51 v33.81,22.51 | 29.05,64.73 29.05,66.32 30.4,67.67 B3.3 | 29.05,64.73 29.05,62.19 29.68,61.56 37.94,61.56 v38.26,61.88 38.57,61.56 41.75,61.56 42.38,60.92 42.38,59.65 43.97,58.06 48.35,58.06 | v41.43,29.49 39.84,29.49 38.89,28.54 v38.89,22.82 | 48.35,58.06 48.42,58.06 49.05,57.43 49.05,38.06 48.73,37.74 47.14,37.74 | v51.59,64.73 51.59,67.59 50.32,68.86 41.11,68.86 40.1,67.84 40.1,67.27 40.41,66.96 B1.6 40.29,66.96 39.59,66.26 | v49.37,59.08 48.35,58.06 | 31.27,21.87 30.63,22.51 29.37,22.51 29.05,22.82 29.05,23.46 28.73,23.77 P2.P$8 | v11.59,22.51 12.22,22.19 12.22,18.38 12.85,17.74 18.57,17.74 18.89,17.42 | 18.89,17.42 19.21,17.74 20.47,17.74 20.79,18.06 v20.79,19.01 | 47.14,37.74 46.83,37.43 v46.83,36.79 | P1.11 P1.10 | P1.11 38.32,40.76 38.32,41.11 v37.05,41.11 37.97,41.11 P1.11 | v44.41,41.11 46.7,38.82 46.7,38.06 47.02,37.74 47.14,37.74 | C5.1 29.05,64.73 | 47.4,65.24 C7.1 v47.46,65.24 | B1.8 40.18,65.66 39.59,66.26 | 39.59,66.26 39.53,66.31 B1.2 | IC1.2 4.56,46.83 4.54,46.83 4.54,45.43 5.55,44.67 C11.+ v7.84,44.16
  Bottom 0.406: R4.2 R3.2 21.11,19.33 v20.79,19.01 | 9.74,25.36 SJ2.1 11.52,25.43 12.22,24.73 12.22,22.82 11.9,22.51 v11.59,22.51 v8.73,22.51 | IC3.20 35.65,38.7 | C6.1 13,45.54 13,48.05 13.17,48.22 | IC4.P$4 10.95,47.23 10.95,42.51 | 10.95,42.51 10.95,42.19 12.85,42.19 | 13.49,42.19 13.49,43.46 14.13,44.1 14.13,49.17 | 14.13,49.17 13.17,48.86 | 12.85,49.17 13.17,48.86 | 13.17,48.86 13.49,48.54 13.81,48.54 13.17,48.86 | 13.17,48.86 13.81,48.86 | 13.81,48.86 13.81,45.68 13.17,45.05 | 13.17,45.05 13.17,43.14 | 13.17,42.82 13.17,42.51 13.81,43.14 13.81,44.41 13.49,44.1 13.49,43.78 13.81,43.46 13.81,42.19 13.49,42.19 | 12.85,42.19 12.54,42.51 | 12.54,42.51 11.27,42.51 | 11.27,42.51 10.95,42.51 | 12.54,42.51 12.85,42.51 | 13.17,42.82 13.17,43.14 | 13.17,43.14 12.85,43.46 | 12.85,43.46 12.85,43.78 | 12.85,47.91 12.85,48.86 12.22,48.22 12.22,44.1 | 12.22,44.1 12.22,42.82 11.9,42.82 11.9,45.68 | 11.9,45.68 11.9,47.91 11.59,47.59 11.59,45.37 | 11.59,45.37 11.59,42.82 | 11.59,42.82 11.27,43.14 | 11.27,43.14 11.27,45.05 | 11.27,45.05 11.27,47.27 | 11.27,43.14 11.27,42.51 | 11.27,42.51 11.59,42.82 | 11.59,42.82 12.54,42.82 12.54,43.14 | 12.54,43.46 12.54,48.22 12.85,47.91 | 12.85,47.91 12.85,45.68 | 12.85,43.46 12.85,42.51 | 12.85,42.51 13.17,42.82 | 13.17,48.22 13.17,48.54 13.49,48.22 13.49,45.68 13.81,45.37 13.81,44.73 C6.1 | C6.1 13.17,45.05 | 14.13,49.17 13.81,48.86 | 13.81,48.86 13.17,48.22 | 13.17,48.22 13.17,46.32 | 13.17,46 13.17,45.37 | 13.17,45.05 13.17,45.37 | 13.17,45.37 C6.1 | 12.85,42.19 13.49,42.19 | 13.49,42.19 12.54,43.14 | 12.54,43.14 12.54,43.46 | 12.54,43.46 12.85,43.78 | 12.85,43.78 12.85,45.68 | 12.85,45.68 13.17,46 | 13.17,46 13.17,46.32
  Bottom 0.406: 13.17,46.32 12.54,45.68 11.9,45.68 | 11.9,45.68 11.59,45.37 | 11.59,45.37 11.27,45.05 | 11.27,45.05 12.22,44.1 | 12.22,44.1 13.17,45.05 | IC4.P$4 12.9,49.17 | 12.9,49.17 12.54,49.17 12.38,49.02 | 12.38,49.02 10.95,47.59 10.95,47.27 12.54,48.86 13.17,48.86 | v17.62,46.95 21.75,46.95 | IC2.8 42.38,28.22 | v46.83,36.79 46.83,31.71 43.34,28.22 IC2.8 | 22.06,46.95 22.7,47.59 R6.2 | 28.73,38.7 27.85,39.58 IC3.6 26.91,39.65 25.56,39.65 24.09,41.11 24.09,42.63 24.86,43.4 24.86,45.17 23.91,46.12 C1.1 22.89,46.12 22.06,46.95 | 27.06,38.06 IC3.4 28.01,37.98 28.73,38.7 | v41.43,29.49 41.69,29.23 IC2.8 | IC4.P$4 13.11,49.17 | 13.11,49.17 12.9,49.17 | 13.11,49.17 14.13,49.17 | v10.95,48.86 11.11,49.02 12.38,49.02 | 36.12,38.78 IC3.20 | v38.89,22.82 38.57,22.51 v33.81,22.51 | C12.4 38.26,65.28 v38.26,61.88 | 28.73,38.7 30,37.43 33.17,37.43 34.44,38.7 34.51,38.7 | IC3.20 35.48,38.7 34.51,38.7 | v49.37,59.08 51.59,61.56 v51.59,64.73 47.97,64.73 v47.46,65.24 | 34.51,38.7 34.51,40.09 34.76,40.35 35.53,40.35 IC3.18 36.57,40.38 v37.05,41.11 v44.41,41.11 | R2.2 21.75,46.95 | 21.75,46.95 22.06,46.95 | v9.62,45.94 v7.84,44.16

### Text on the board
tPlace: S1 | S2 | S3
tNames: B3 | DIEC 3.5.21 | P2 | GND